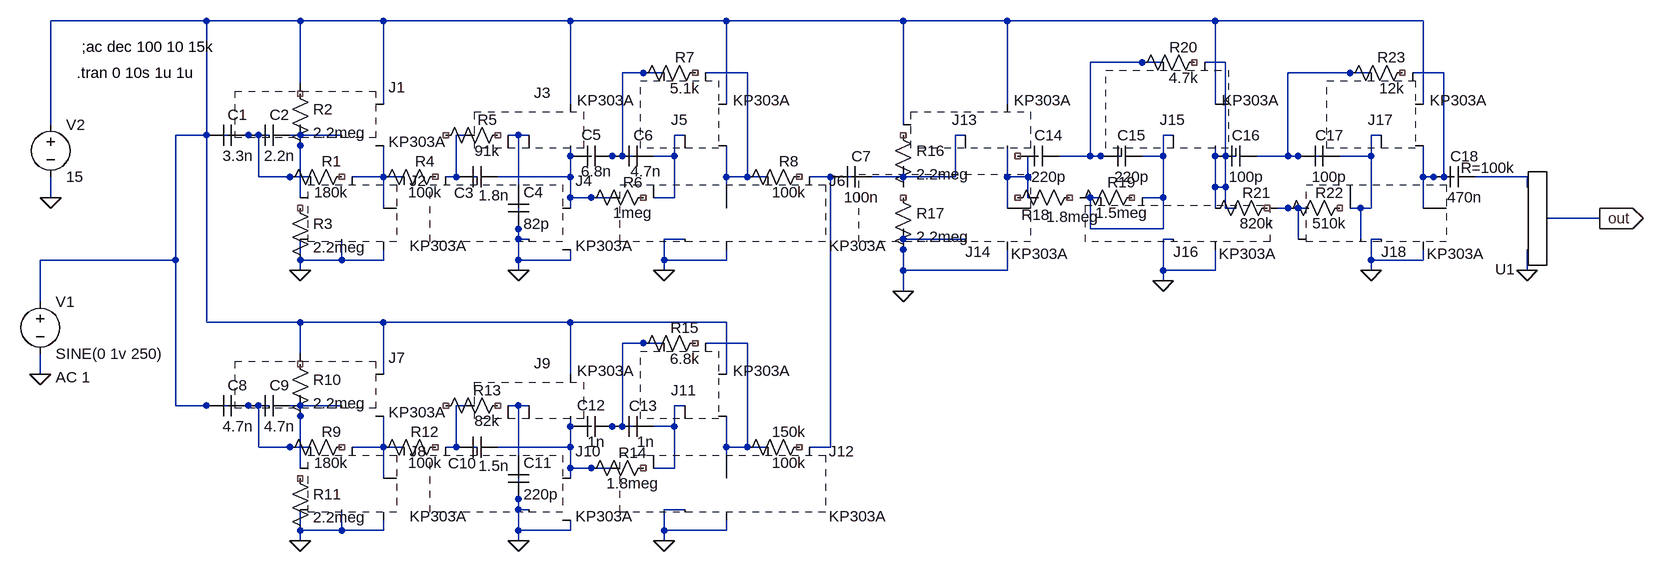
[diagram p0: schematic Magnum MkII.asc]
Magnum MkII.asc, the LTspice schematic file:
Version 4
SHEET 1 2240 772
WIRE 0 -48 -240 -48
WIRE 144 -48 0 -48
WIRE 272 -48 144 -48
WIRE 560 -48 272 -48
WIRE 800 -48 560 -48
WIRE 1072 -48 800 -48
WIRE 1232 -48 1072 -48
WIRE 1552 -48 1232 -48
WIRE 1872 -48 1552 -48
WIRE 1472 16 1360 16
WIRE 1568 16 1536 16
WIRE 704 32 640 32
WIRE 832 32 768 32
WIRE 1792 32 1664 32
WIRE 1904 32 1856 32
WIRE 144 48 144 -48
WIRE 272 80 272 -48
WIRE 560 80 560 -48
WIRE 800 80 800 -48
WIRE 1232 80 1232 -48
WIRE 1552 80 1552 -48
WIRE 1872 80 1872 -48
WIRE -240 112 -240 -48
WIRE 1072 112 1072 -48
WIRE 32 128 -48 128
WIRE 80 128 64 128
WIRE 96 128 80 128
WIRE 144 128 144 112
WIRE 144 128 128 128
WIRE 208 128 144 128
WIRE 400 128 384 128
WIRE 480 128 464 128
WIRE 496 128 480 128
WIRE 736 128 720 128
WIRE 1168 128 1152 128
WIRE 1488 128 1472 128
WIRE 1808 128 1792 128
WIRE 560 160 560 144
WIRE 592 160 560 160
WIRE 640 160 640 32
WIRE 640 160 624 160
WIRE 656 160 640 160
WIRE 720 160 720 128
WIRE 720 160 688 160
WIRE 1280 160 1264 160
WIRE 1360 160 1360 16
WIRE 1360 160 1312 160
WIRE 1408 160 1360 160
WIRE 1472 160 1472 128
WIRE 1472 160 1440 160
WIRE 1568 160 1568 16
WIRE 1584 160 1568 160
WIRE 1664 160 1664 32
WIRE 1664 160 1616 160
WIRE 1712 160 1664 160
WIRE 1792 160 1792 128
WIRE 1792 160 1744 160
WIRE 80 192 80 128
WIRE 160 192 80 192
WIRE 272 192 272 144
WIRE 272 192 224 192
WIRE 304 192 272 192
WIRE 384 192 384 128
WIRE 384 192 368 192
WIRE 416 192 384 192
WIRE 560 192 560 160
WIRE 560 192 448 192
WIRE 800 192 800 144
WIRE 832 192 832 32
WIRE 832 192 800 192
WIRE 864 192 832 192
WIRE 960 192 928 192
WIRE 992 192 960 192
WIRE 1072 192 1072 176
WIRE 1072 192 1024 192
WIRE 1152 192 1152 128
WIRE 1152 192 1072 192
WIRE 1232 192 1232 144
WIRE 1264 192 1264 160
WIRE 1264 192 1232 192
WIRE 1872 192 1872 144
WIRE 1904 192 1904 32
WIRE 1904 192 1872 192
WIRE 1920 192 1904 192
WIRE 2032 192 1952 192
WIRE 480 208 480 128
WIRE 1072 208 1072 192
WIRE 1552 208 1552 144
WIRE 1568 208 1568 160
WIRE 1568 208 1552 208
WIRE 2032 208 2032 192
WIRE -240 224 -240 192
WIRE 144 224 144 128
WIRE 560 224 560 192
WIRE 624 224 560 224
WIRE 720 224 720 160
WIRE 720 224 688 224
WIRE 1264 224 1264 192
WIRE 1280 224 1264 224
WIRE 1360 224 1344 224
WIRE 1376 224 1360 224
WIRE 1472 224 1472 160
WIRE 1472 224 1440 224
WIRE 272 240 272 192
WIRE 560 240 560 224
WIRE 800 240 800 192
WIRE 1232 240 1232 192
WIRE 1552 240 1552 208
WIRE 1568 240 1568 208
WIRE 1584 240 1568 240
WIRE 1680 240 1648 240
WIRE 1696 240 1680 240
WIRE 1776 240 1760 240
WIRE 1792 240 1792 160
WIRE 1792 240 1776 240
WIRE 1872 240 1872 192
WIRE 2144 256 2064 256
WIRE 1360 272 1360 224
WIRE 1472 272 1472 224
WIRE 1472 272 1360 272
WIRE 480 288 480 240
WIRE 496 288 480 288
WIRE 736 288 704 288
WIRE 1072 288 1072 272
WIRE 1168 288 1072 288
WIRE 1488 288 1472 288
WIRE 1680 288 1680 240
WIRE 1776 288 1776 240
WIRE 1808 288 1792 288
WIRE -48 320 -48 128
WIRE -48 320 -256 320
WIRE 144 320 144 288
WIRE 208 320 208 288
WIRE 208 320 144 320
WIRE 272 320 272 304
WIRE 272 320 208 320
WIRE 480 320 480 288
WIRE 560 320 560 304
WIRE 560 320 480 320
WIRE 704 320 704 288
WIRE 800 320 800 304
WIRE 800 320 704 320
WIRE 1792 320 1792 288
WIRE 1872 320 1872 304
WIRE 1872 320 1792 320
WIRE 144 336 144 320
WIRE 480 336 480 320
WIRE 704 336 704 320
WIRE 1072 336 1072 288
WIRE 1232 336 1232 304
WIRE 1232 336 1072 336
WIRE 1472 336 1472 288
WIRE 1552 336 1552 304
WIRE 1552 336 1472 336
WIRE 1792 336 1792 320
WIRE 2032 336 2032 304
WIRE 1472 352 1472 336
WIRE 1072 368 1072 336
WIRE -256 384 -256 320
WIRE 0 416 0 -48
WIRE 144 416 0 416
WIRE 272 416 144 416
WIRE 560 416 272 416
WIRE 800 416 560 416
WIRE 704 448 640 448
WIRE 832 448 768 448
WIRE 144 464 144 416
WIRE -256 496 -256 464
WIRE 272 496 272 416
WIRE 560 496 560 416
WIRE 800 496 800 416
WIRE -48 544 -48 320
WIRE 32 544 -48 544
WIRE 80 544 64 544
WIRE 96 544 80 544
WIRE 144 544 144 528
WIRE 144 544 128 544
WIRE 208 544 144 544
WIRE 400 544 384 544
WIRE 480 544 464 544
WIRE 496 544 480 544
WIRE 736 544 720 544
WIRE 560 576 560 560
WIRE 592 576 560 576
WIRE 640 576 640 448
WIRE 640 576 624 576
WIRE 656 576 640 576
WIRE 720 576 720 544
WIRE 720 576 688 576
WIRE 80 608 80 544
WIRE 160 608 80 608
WIRE 272 608 272 560
WIRE 272 608 224 608
WIRE 304 608 272 608
WIRE 384 608 384 544
WIRE 384 608 368 608
WIRE 416 608 384 608
WIRE 560 608 560 576
WIRE 560 608 448 608
WIRE 800 608 800 560
WIRE 832 608 832 448
WIRE 832 608 800 608
WIRE 864 608 832 608
WIRE 960 608 960 192
WIRE 960 608 928 608
WIRE 480 624 480 544
WIRE 144 640 144 544
WIRE 560 640 560 608
WIRE 624 640 560 640
WIRE 720 640 720 576
WIRE 720 640 688 640
WIRE 272 656 272 608
WIRE 560 656 560 640
WIRE 800 656 800 608
WIRE 480 704 480 656
WIRE 496 704 480 704
WIRE 736 704 704 704
WIRE 144 736 144 704
WIRE 208 736 208 704
WIRE 208 736 144 736
WIRE 272 736 272 720
WIRE 272 736 208 736
WIRE 480 736 480 704
WIRE 560 736 560 720
WIRE 560 736 480 736
WIRE 704 736 704 704
WIRE 800 736 800 720
WIRE 800 736 704 736
WIRE 144 752 144 736
WIRE 480 752 480 736
WIRE 704 752 704 736
FLAG 144 336 0
FLAG 480 336 0
FLAG 704 336 0
FLAG 144 752 0
FLAG 480 752 0
FLAG 704 752 0
FLAG -256 496 0
FLAG 1072 368 0
FLAG 1472 352 0
FLAG 2032 336 0
FLAG 1792 336 0
FLAG -240 224 0
FLAG 2144 256 out
IOPIN 2144 256 Out
SYMBOL cap 64 112 R90
WINDOW 0 0 16 VBottom 0
WINDOW 3 32 16 VTop 0
SYMATTR InstName C1
SYMATTR Value 3.3n
SYMBOL cap 128 112 R90
WINDOW 0 0 16 VBottom 0
WINDOW 3 32 16 VTop 0
SYMATTR InstName C2
SYMATTR Value 2.2n
SYMBOL res 224 176 R90
WINDOW 0 8 32 VBottom 0
WINDOW 3 24 32 VTop 0
SYMATTR InstName R1
SYMATTR Value 180k
SYMBOL res 128 48 R0
SYMATTR InstName R2
SYMATTR Value 2.2meg
SYMBOL res 128 224 R0
SYMATTR InstName R3
SYMATTR Value 2.2meg
SYMBOL FET\\njf2 208 80 R0
SYMATTR InstName J1
SYMATTR Value KP303A
SYMBOL FET\\njf2 208 240 R0
SYMATTR InstName J2
SYMATTR Value KP303A
SYMBOL res 368 176 R90
WINDOW 0 8 32 VBottom 0
WINDOW 3 24 32 VTop 0
SYMATTR InstName R4
SYMATTR Value 100k
SYMBOL res 464 112 R90
WINDOW 0 8 32 VBottom 0
WINDOW 3 24 32 VTop 0
SYMATTR InstName R5
SYMATTR Value 91k
SYMBOL cap 448 176 R90
WINDOW 0 56 52 VBottom 0
WINDOW 3 29 6 VTop 0
SYMATTR InstName C3
SYMATTR Value 1.8n
SYMBOL FET\\njf2 496 80 R0
WINDOW 0 8 -17 Left 0
WINDOW 3 74 -6 Left 0
SYMATTR InstName J3
SYMATTR Value KP303A
SYMBOL FET\\njf2 496 240 R0
SYMATTR InstName J4
SYMATTR Value KP303A
SYMBOL cap 464 208 R0
SYMATTR InstName C4
SYMATTR Value 82p
SYMBOL cap 624 144 R90
WINDOW 0 -1 32 VBottom 0
WINDOW 3 24 24 VTop 0
SYMATTR InstName C5
SYMATTR Value 6.8n
SYMBOL res 688 208 R90
WINDOW 0 8 32 VBottom 0
WINDOW 3 24 32 VTop 0
SYMATTR InstName R6
SYMATTR Value 1meg
SYMBOL res 768 16 R90
WINDOW 0 8 32 VBottom 0
WINDOW 3 24 32 VTop 0
SYMATTR InstName R7
SYMATTR Value 5.1k
SYMBOL cap 688 144 R90
WINDOW 0 0 16 VBottom 0
WINDOW 3 24 12 VTop 0
SYMATTR InstName C6
SYMATTR Value 4.7n
SYMBOL FET\\njf2 736 80 R0
WINDOW 0 -21 24 Left 0
WINDOW 3 74 -6 Left 0
SYMATTR InstName J5
SYMATTR Value KP303A
SYMBOL FET\\njf2 736 240 R0
SYMATTR InstName J6
SYMATTR Value KP303A
SYMBOL res 928 176 R90
WINDOW 0 8 32 VBottom 0
WINDOW 3 24 32 VTop 0
SYMATTR InstName R8
SYMATTR Value 100k
SYMBOL cap 1024 176 R90
WINDOW 0 0 16 VBottom 0
WINDOW 3 32 16 VTop 0
SYMATTR InstName C7
SYMATTR Value 100n
SYMBOL cap 64 528 R90
WINDOW 0 0 16 VBottom 0
WINDOW 3 32 16 VTop 0
SYMATTR InstName C8
SYMATTR Value 4.7n
SYMBOL cap 128 528 R90
WINDOW 0 0 16 VBottom 0
WINDOW 3 32 16 VTop 0
SYMATTR InstName C9
SYMATTR Value 4.7n
SYMBOL res 224 592 R90
WINDOW 0 8 32 VBottom 0
WINDOW 3 24 32 VTop 0
SYMATTR InstName R9
SYMATTR Value 180k
SYMBOL res 128 464 R0
SYMATTR InstName R10
SYMATTR Value 2.2meg
SYMBOL res 128 640 R0
SYMATTR InstName R11
SYMATTR Value 2.2meg
SYMBOL FET\\njf2 208 496 R0
SYMATTR InstName J7
SYMATTR Value KP303A
SYMBOL FET\\njf2 208 656 R0
SYMATTR InstName J8
SYMATTR Value KP303A
SYMBOL res 368 592 R90
WINDOW 0 8 32 VBottom 0
WINDOW 3 24 32 VTop 0
SYMATTR InstName R12
SYMATTR Value 100k
SYMBOL res 464 528 R90
WINDOW 0 8 32 VBottom 0
WINDOW 3 24 32 VTop 0
SYMATTR InstName R13
SYMATTR Value 82k
SYMBOL cap 448 592 R90
WINDOW 0 56 54 VBottom 0
WINDOW 3 29 6 VTop 0
SYMATTR InstName C10
SYMATTR Value 1.5n
SYMBOL FET\\njf2 496 496 R0
WINDOW 0 8 -17 Left 0
WINDOW 3 74 -6 Left 0
SYMATTR InstName J9
SYMATTR Value KP303A
SYMBOL FET\\njf2 496 656 R0
SYMATTR InstName J10
SYMATTR Value KP303A
SYMBOL cap 464 624 R0
SYMATTR InstName C11
SYMATTR Value 220p
SYMBOL cap 624 560 R90
WINDOW 0 -1 32 VBottom 0
WINDOW 3 24 24 VTop 0
SYMATTR InstName C12
SYMATTR Value 1n
SYMBOL res 688 624 R90
WINDOW 0 8 32 VBottom 0
WINDOW 3 24 32 VTop 0
SYMATTR InstName R14
SYMATTR Value 1.8meg
SYMBOL res 768 432 R90
WINDOW 0 8 32 VBottom 0
WINDOW 3 24 32 VTop 0
SYMATTR InstName R15
SYMATTR Value 6.8k
SYMBOL cap 688 560 R90
WINDOW 0 0 16 VBottom 0
WINDOW 3 24 12 VTop 0
SYMATTR InstName C13
SYMATTR Value 1n
SYMBOL FET\\njf2 736 496 R0
WINDOW 0 -21 24 Left 0
WINDOW 3 74 -6 Left 0
SYMATTR InstName J11
SYMATTR Value KP303A
SYMBOL FET\\njf2 736 656 R0
SYMATTR InstName J12
SYMATTR Value KP303A
SYMBOL res 928 592 R90
WINDOW 0 8 32 VBottom 0
WINDOW 3 24 32 VTop 0
SYMATTR InstName 150k
SYMATTR Value 100k
SYMBOL voltage -256 368 R0
WINDOW 123 24 132 Left 0
WINDOW 39 0 0 Left 0
SYMATTR InstName V1
SYMATTR Value SINE(0 1v 250)
SYMATTR Value2 AC 1
SYMBOL FET\\njf2 1168 80 R0
WINDOW 0 -21 24 Left 0
WINDOW 3 74 -6 Left 0
SYMATTR InstName J13
SYMATTR Value KP303A
SYMBOL FET\\njf2 1168 240 R0
WINDOW 0 0 67 Left 0
WINDOW 3 70 70 Left 0
SYMATTR InstName J14
SYMATTR Value KP303A
SYMBOL res 1056 112 R0
SYMATTR InstName R16
SYMATTR Value 2.2meg
SYMBOL res 1056 208 R0
SYMATTR InstName R17
SYMATTR Value 2.2meg
SYMBOL cap 1312 144 R90
WINDOW 0 0 16 VBottom 0
WINDOW 3 32 16 VTop 0
SYMATTR InstName C14
SYMATTR Value 220p
SYMBOL res 1344 208 R90
WINDOW 0 58 68 VBottom 0
WINDOW 3 30 11 VTop 0
SYMATTR InstName R18
SYMATTR Value 1.8meg
SYMBOL cap 1440 144 R90
WINDOW 0 0 16 VBottom 0
WINDOW 3 32 16 VTop 0
SYMATTR InstName C15
SYMATTR Value 220p
SYMBOL res 1440 208 R90
WINDOW 0 8 32 VBottom 0
WINDOW 3 24 32 VTop 0
SYMATTR InstName R19
SYMATTR Value 1.5meg
SYMBOL FET\\njf2 1488 80 R0
WINDOW 0 -21 24 Left 0
WINDOW 3 74 -6 Left 0
SYMATTR InstName J15
SYMATTR Value KP303A
SYMBOL FET\\njf2 1488 240 R0
WINDOW 0 0 67 Left 0
WINDOW 3 70 70 Left 0
SYMATTR InstName J16
SYMATTR Value KP303A
SYMBOL res 1536 0 R90
WINDOW 0 8 32 VBottom 0
WINDOW 3 24 32 VTop 0
SYMATTR InstName R20
SYMATTR Value 4.7k
SYMBOL cap 1616 144 R90
WINDOW 0 0 16 VBottom 0
WINDOW 3 32 16 VTop 0
SYMATTR InstName C16
SYMATTR Value 100p
SYMBOL cap 1744 144 R90
WINDOW 0 0 16 VBottom 0
WINDOW 3 32 16 VTop 0
SYMATTR InstName C17
SYMATTR Value 100p
SYMBOL res 1648 224 R90
WINDOW 0 8 32 VBottom 0
WINDOW 3 24 32 VTop 0
SYMATTR InstName R21
SYMATTR Value 820k
SYMBOL res 1760 224 R90
WINDOW 0 8 32 VBottom 0
WINDOW 3 24 32 VTop 0
SYMATTR InstName R22
SYMATTR Value 510k
SYMBOL FET\\njf2 1808 80 R0
WINDOW 0 -21 24 Left 0
WINDOW 3 74 -6 Left 0
SYMATTR InstName J17
SYMATTR Value KP303A
SYMBOL FET\\njf2 1808 240 R0
WINDOW 0 0 67 Left 0
WINDOW 3 70 70 Left 0
SYMATTR InstName J18
SYMATTR Value KP303A
SYMBOL res 1856 16 R90
WINDOW 0 8 32 VBottom 0
WINDOW 3 24 32 VTop 0
SYMATTR InstName R23
SYMATTR Value 12k
SYMBOL cap 1952 176 R90
WINDOW 0 0 16 VBottom 0
WINDOW 3 32 16 VTop 0
SYMATTR InstName C18
SYMATTR Value 470n
SYMBOL EXTRA\\Misc\\pot 2032 256 R180
SYMATTR InstName U1
SYMATTR Value R=100k
SYMATTR Value2 T=.05
SYMBOL voltage -240 96 R0
WINDOW 123 0 0 Left 0
WINDOW 39 0 0 Left 0
SYMATTR InstName V2
SYMATTR Value 15
TEXT -192 -8 Left 0 !;ac dec 100 10 15k
TEXT -200 32 Left 0 !.tran 0 10s 1u 1u

The netlist it stands for:
* Magnum MkII.asc
C1 N008 N001 3.3n
C2 N009 N008 2.2n
R1 NC_01 N008 180k
R2 NC_02 N009 2.2meg
R3 NC_03 0 2.2meg
* J1: KP303A (symbol FET\njf2 not available, pin order unknown); nets seen at it: N001, N008, N009, N018
* J2: KP303A (symbol FET\njf2 not available, pin order unknown); nets seen at it: 0, N008, N009, N018
R4 NC_04 N018 100k
R5 NC_05 NC_06 91k
C3 N016 N010 1.8n
* J3: KP303A (symbol FET\njf2 not available, pin order unknown); nets seen at it: N001, N010, N011, N016
* J4: KP303A (symbol FET\njf2 not available, pin order unknown); nets seen at it: 0, N010, N016
C4 N011 0 82p
C5 N004 N016 6.8n
R6 NC_07 N016 1meg
R7 NC_08 N004 5.1k
C6 N012 N004 4.7n
* J5: KP303A (symbol FET\njf2 not available, pin order unknown); nets seen at it: N001, N004, N005, N012
* J6: KP303A (symbol FET\njf2 not available, pin order unknown); nets seen at it: 0, N005, N012, N016, N019
R8 NC_09 N005 100k
C7 N013 N019 100n
C8 N024 N001 4.7n
C9 N025 N024 4.7n
R9 NC_10 N024 180k
R10 NC_11 N025 2.2meg
R11 NC_12 0 2.2meg
* J7: KP303A (symbol FET\njf2 not available, pin order unknown); nets seen at it: N001, N024, N025, N030
* J8: KP303A (symbol FET\njf2 not available, pin order unknown); nets seen at it: 0, N024, N025, N030
R12 NC_13 N030 100k
R13 NC_14 NC_15 82k
C10 N029 N026 1.5n
* J9: KP303A (symbol FET\njf2 not available, pin order unknown); nets seen at it: N001, N026, N027, N029
* J10: KP303A (symbol FET\njf2 not available, pin order unknown); nets seen at it: 0, N026, N029
C11 N027 0 220p
C12 N022 N029 1n
R14 NC_16 N029 1.8meg
R15 NC_17 N022 6.8k
C13 N028 N022 1n
* J11: KP303A (symbol FET\njf2 not available, pin order unknown); nets seen at it: N001, N022, N023, N028
* J12: KP303A (symbol FET\njf2 not available, pin order unknown); nets seen at it: 0, N019, N023, N028, N029
R§150k NC_18 N023 100k
V1 N001 0 SINE(0 1v 250) AC 1
* J13: KP303A (symbol FET\njf2 not available, pin order unknown); nets seen at it: N001, N013, N017
* J14: KP303A (symbol FET\njf2 not available, pin order unknown); nets seen at it: 0, N013, N017, N019
R16 NC_19 N013 2.2meg
R17 NC_20 0 2.2meg
C14 N002 NC_21 220p
R18 NC_22 NC_23 1.8meg
C15 N014 N002 220p
R19 NC_24 N014 1.5meg
* J15: KP303A (symbol FET\njf2 not available, pin order unknown); nets seen at it: N001, N002, N003, N014
* J16: KP303A (symbol FET\njf2 not available, pin order unknown); nets seen at it: 0, N003, N014, N021
R20 NC_25 N002 4.7k
C16 N006 N003 100p
C17 N015 N006 100p
R21 NC_26 N003 820k
R22 NC_27 N021 510k
* J17: KP303A (symbol FET\njf2 not available, pin order unknown); nets seen at it: N001, N006, N007, N015
* J18: KP303A (symbol FET\njf2 not available, pin order unknown); nets seen at it: 0, N007, N015, N021
R23 NC_28 N006 12k
C18 N020 N007 470n
XU1 0 N020 out R=100k T=.05
V2 N001 0 15
;ac dec 100 10 15k
.tran 0 10s 1u 1u
.lib POT.lib
.backanno
.end